# Altium schematic sheet BLOCK_DIAGRAM.SchDoc
size 420 x 297 mm; Date: 21/02/2025; Address1: BEE-PC1; SheetNumber: 2; SheetTotal: 4
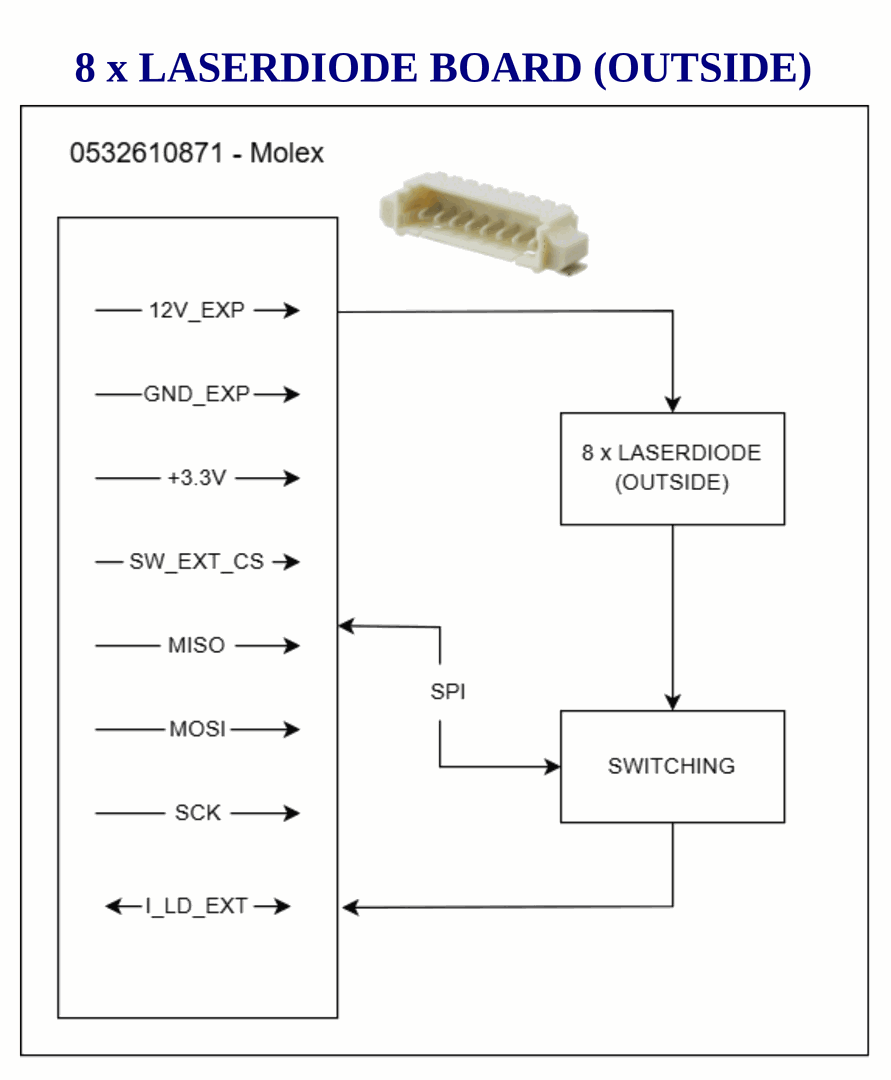
[diagram p0: BLOCK_DIAGRAM.SchDoc]

## Notes on the sheet
- 8 x LASERDIODE BOARD (OUTSIDE)
- Project:
- Sub-system:
- Design by:
- SAMY VE
- BAO BUI Q.
- Sheet title:
- Sheet
- A3
- of
- Checked by:
- Approved by:
- VU PHAM
- Revision:
- Document No:
- V1.1.0
- Size:
- Date: